# Altium schematic sheet DSP.SchDoc
size A4
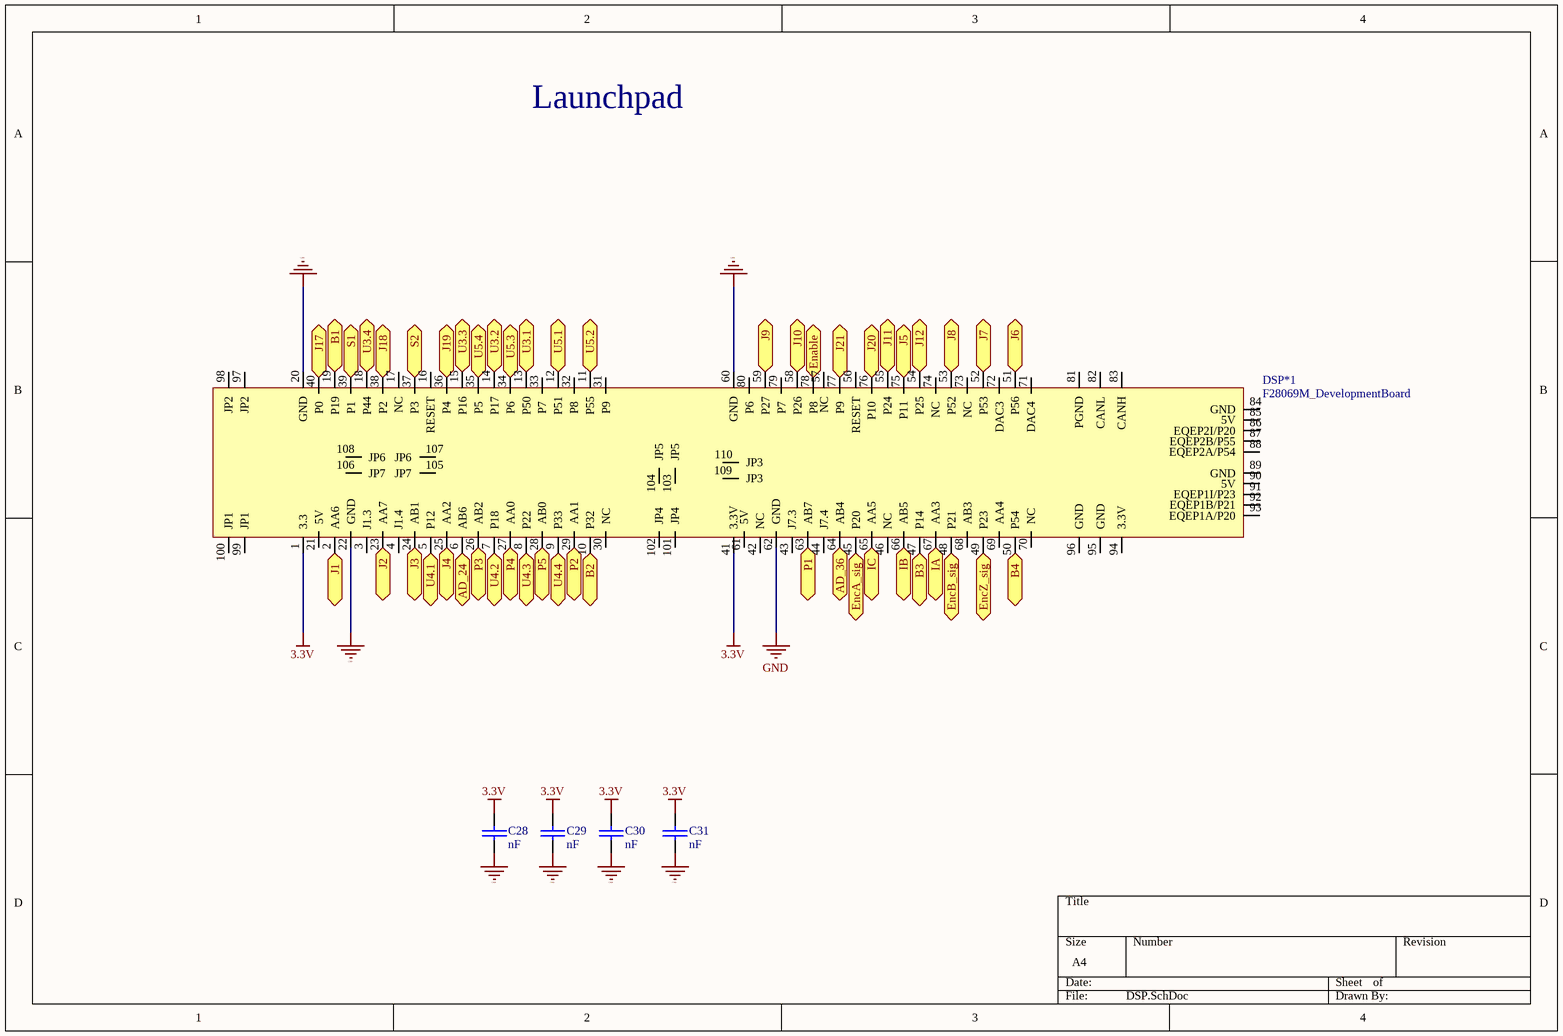
[diagram p0: DSP.SchDoc]

## Parts
C28  nF  [1206]
C29  nF  [1206]
C30  nF  [1206]
C31  nF  [1206]
DSP*1  F28069M_DevelopmentBoard  [F28069M_DevelopmentBoardDOWN]

## Ports
AD_24, AD_36, B1, B2, B3, B4, Enable, EncA_sig, EncB_sig, EncZ_sig, IA, IB, IC, J1, J2, J3, J4, J5, J6, J7, J8, J9, J10, J11, J12, J17, J18, J19, J20, J21, P1, P2, P3, P4, P5, S1, S2, U3.1, U3.2, U3.3, U3.4, U4.1, U4.2, U4.3, U4.4, U5.1, U5.2, U5.3, U5.4

## Nets
3.3V: C28.1 C29.1 C30.1 C31.1 DSP*1.1(3.3) DSP*1.41(3.3V)
GND: C28.2 C29.2 C30.2 C31.2 DSP*1.20(GND) DSP*1.22(GND) DSP*1.60(GND) DSP*1.62(GND)
AD_24: DSP*1.6(AB6) ; port AD_24
AD_36: DSP*1.64(AB4) ; port AD_36
B1: DSP*1.19(P19) ; port B1
B2: DSP*1.10(P32) ; port B2
B3: DSP*1.47(P14) ; port B3
B4: DSP*1.50(P54) ; port B4
Enable: DSP*1.78(P8) ; port Enable
EncA_sig: DSP*1.45(P20) ; port EncA_sig
EncB_sig: DSP*1.48(P21) ; port EncB_sig
EncZ_sig: DSP*1.49(P23) ; port EncZ_sig
IA: DSP*1.67(AA3) ; port IA
IB: DSP*1.66(AB5) ; port IB
IC: DSP*1.65(AA5) ; port IC
J1: DSP*1.2(AA6) ; port J1
J2: DSP*1.23(AA7) ; port J2
J3: DSP*1.24(AB1) ; port J3
J4: DSP*1.25(AA2) ; port J4
J5: DSP*1.75(P11) ; port J5
J6: DSP*1.51(P56) ; port J6
J7: DSP*1.52(P53) ; port J7
J8: DSP*1.53(P52) ; port J8
J9: DSP*1.59(P27) ; port J9
J10: DSP*1.58(P26) ; port J10
J11: DSP*1.55(P24) ; port J11
J12: DSP*1.54(P25) ; port J12
J17: DSP*1.40(P0) ; port J17
J18: DSP*1.38(P2) ; port J18
J19: DSP*1.36(P4) ; port J19
J20: DSP*1.76(P10) ; port J20
J21: DSP*1.77(P9) ; port J21
P1: DSP*1.63(AB7) ; port P1
P2: DSP*1.29(AA1) ; port P2
P3: DSP*1.26(AB2) ; port P3
P4: DSP*1.27(AA0) ; port P4
P5: DSP*1.28(AB0) ; port P5
S1: DSP*1.39(P1) ; port S1
S2: DSP*1.37(P3) ; port S2
U3.1: DSP*1.13(P50) ; port U3.1
U3.2: DSP*1.14(P17) ; port U3.2
U3.3: DSP*1.15(P16) ; port U3.3
U3.4: DSP*1.18(P44) ; port U3.4
U4.1: DSP*1.5(P12) ; port U4.1
U4.2: DSP*1.7(P18) ; port U4.2
U4.3: DSP*1.8(P22) ; port U4.3
U4.4: DSP*1.9(P33) ; port U4.4
U5.1: DSP*1.12(P51) ; port U5.1
U5.2: DSP*1.11(P55) ; port U5.2
U5.3: DSP*1.34(P6) ; port U5.3
U5.4: DSP*1.35(P5) ; port U5.4

Not connected (* = marked no-connect by the designer): DSP*1 3(J1.3) 4(J1.4) 16(RESET) 17(NC) 21(5V) 30(NC) 31(P9) 32(P8) 33(P7) 42(NC) 43(J7.3) 44(J7.4) 46(NC) 56(RESET) 57(NC) 61(5V) 68(AB3) 69(AA4) 70(NC) 71(DAC4) 72(DAC3) 73(NC) 74(NC) 79(P7) 80(P6) 81(PGND) 82(CANL) 83(CANH) 84(GND) 85(5V) 86(EQEP2I/P20) 87(EQEP2B/P55) 88(EQEP2A/P54) 89(GND) 90(5V) 91(EQEP1I/P23) 92(EQEP1B/P21) 93(EQEP1A/P20) 94(3.3V) 95(GND) 96(GND) 97(JP2) 98(JP2) 99(JP1) 100(JP1) 101(JP4) 102(JP4) 103(JP5) 104(JP5) 105(JP7) 106(JP7) 107(JP6) 108(JP6) 109(JP3) 110(JP3)

## Notes on the sheet
- Launchpad

## Library data of the parts
C28-C31 = Condensador